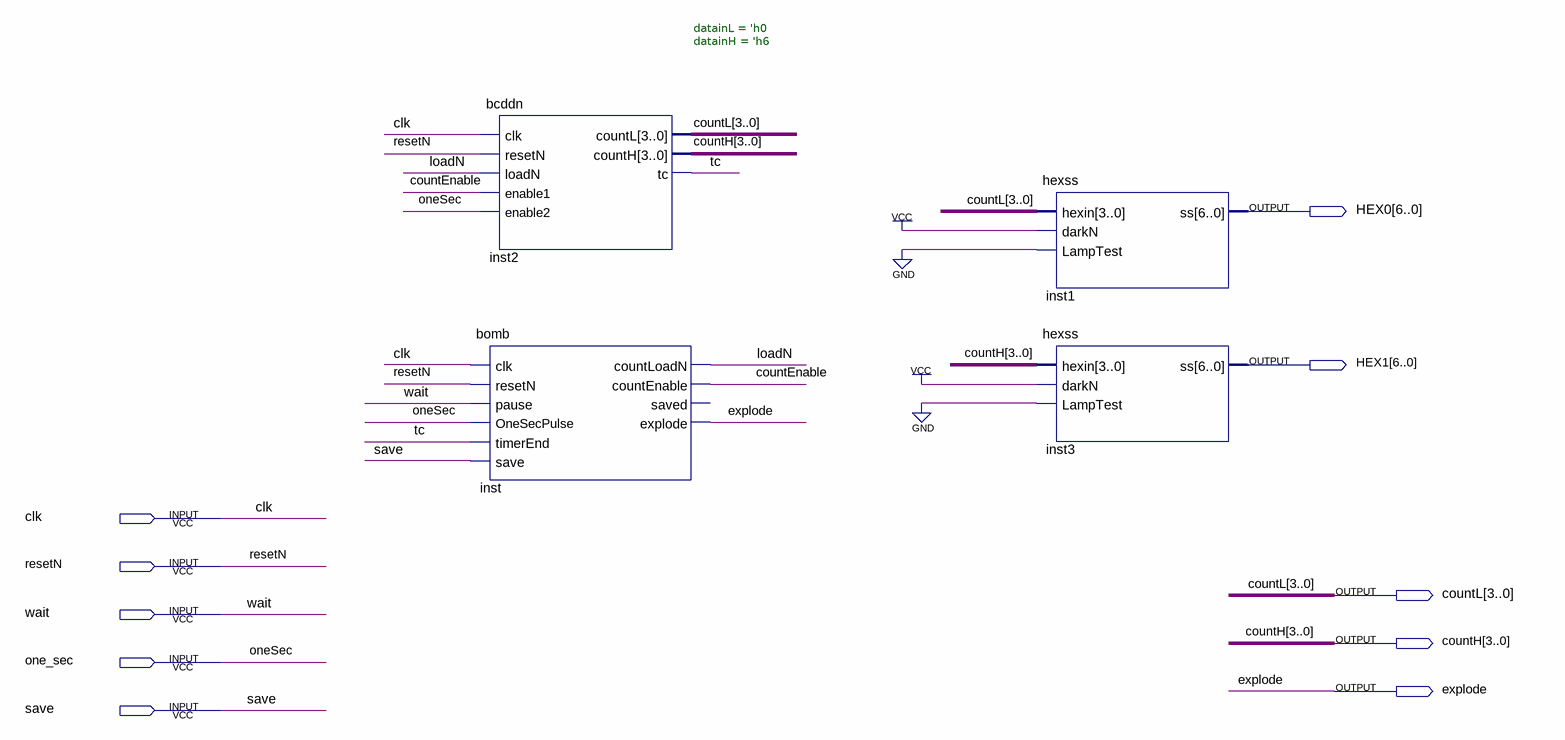
[diagram p0: schematic sheet]
// Quartus schematic timeBombTOP.bdf as structural Verilog: 4 symbols, 10 pins
module timeBombTOP (
  input  clk,
  input  resetN,
  input  \wait ,
  input  one_sec,
  input  save,
  output [6:0] HEX0,
  output [6:0] HEX1,
  output [3:0] countL,
  output [3:0] countH,
  output explode
);

  wire countEnable, loadN, tc;

  bcddn #(.datainL('h0), .datainH('h6)) inst2 (
    .clk(clk), .resetN(resetN), .loadN(loadN), .enable1(countEnable), .enable2(one_sec), .countL(countL),
    .countH(countH), .tc(tc));
  bomb inst (
    .clk(clk), .resetN(resetN), .pause(\wait ), .OneSecPulse(one_sec), .timerEnd(tc), .save(save),
    .countLoadN(loadN), .countEnable(countEnable), .explode(explode));  // open: saved
  hexss inst1 (.hexin(countL), .darkN(1'b1), .LampTest(1'b0), .ss(HEX0));
  hexss inst3 (.hexin(countH), .darkN(1'b1), .LampTest(1'b0), .ss(HEX1));

  // Other names for the same wires on the sheet: oneSec = one_sec
endmodule
